# Altium schematic sheet CON_LCD_INDM.SchDoc: TFT LCD Header
size A4; Organization: Altium Limited.; Address1: Level 3, 12a Rodborough Rd; Address2: Frenchs Forest 2086; Address3: NSW; Address4: AUSTRALIA; Revision: 6; SheetNumber: 48; SheetTotal: 64
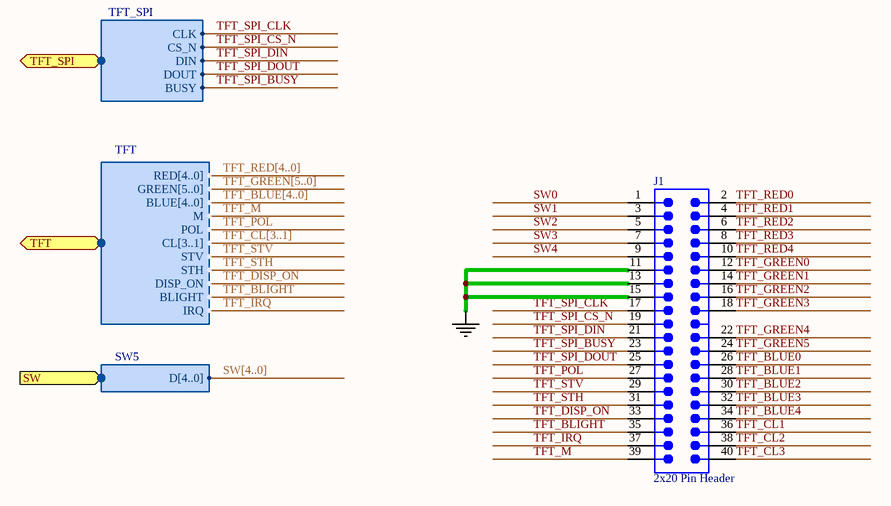
[diagram p0: CON_LCD_INDM.SchDoc]

## Parts
J1  2x20 Pin Header  [HDR2X20]

## Ports
SW (harness SW5), TFT (harness TFT), TFT_SPI (harness TFT_SPI)

## Harnesses
TFT_SPI: CLK, CS_N, DIN, DOUT, BUSY
TFT: IRQ, BLIGHT, POL, DISP_ON, STV, STH, M, CL[3..1], RED[4..0], GREEN[5..0], BLUE[4..0]
SW5: D[4..0]

## Nets
GND: J1.11 J1.13 J1.15
SW0: J1.1
SW1: J1.3
SW2: J1.5
SW3: J1.7
SW4: J1.9
TFT_BLIGHT: J1.35 ; port TFT.BLIGHT
TFT_BLUE0: J1.26
TFT_BLUE1: J1.28
TFT_BLUE2: J1.30
TFT_BLUE3: J1.32
TFT_BLUE4: J1.34
TFT_CL1: J1.36
TFT_CL2: J1.38
TFT_CL3: J1.40
TFT_DISP_ON: J1.33 ; port TFT.DISP_ON
TFT_GREEN0: J1.12
TFT_GREEN1: J1.14
TFT_GREEN2: J1.16
TFT_GREEN3: J1.18
TFT_GREEN4: J1.22
TFT_GREEN5: J1.24
TFT_IRQ: J1.37 ; port TFT.IRQ
TFT_M: J1.39 ; port TFT.M
TFT_POL: J1.27 ; port TFT.POL
TFT_RED0: J1.2
TFT_RED1: J1.4
TFT_RED2: J1.6
TFT_RED3: J1.8
TFT_RED4: J1.10
TFT_SPI_BUSY: J1.23 ; port TFT_SPI.BUSY
TFT_SPI_CLK: J1.17 ; port TFT_SPI.CLK
TFT_SPI_CS_N: J1.19 ; port TFT_SPI.CS_N
TFT_SPI_DIN: J1.21 ; port TFT_SPI.DIN
TFT_SPI_DOUT: J1.25 ; port TFT_SPI.DOUT
TFT_STH: J1.31 ; port TFT.STH
TFT_STV: J1.29 ; port TFT.STV

## Buses and harness runs
bus SW[4..0]
bus TFT_BLUE[4..0]
bus TFT_CL[3..1]
bus TFT_GREEN[5..0]
bus TFT_RED[4..0]

## Notes on the sheet
- Sheet Title
- Project Title
- Size:
- Date:
- A4
- Assy:
- Time:
- Sheet
- Revision:
- of
- File:

## Library data of the parts
J1 = D-300-0047: Header, IDC, 2x20 pin Vertical; Max Current: mA; Connector type: Header; Mounting Technology: Through-Hole; Pin Count: 40; Status: Unreleased; Category: Connector